# Altium schematic sheet TC-ADAPT.SchDoc
size A
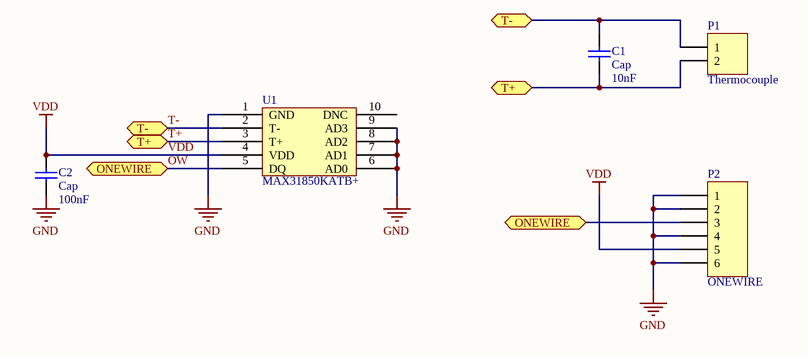
[diagram p0: TC-ADAPT.SchDoc]

## Parts
C1  Cap  value 10nF  [0603]
C2  Cap  value 100nF  [0603]
P1  Thermocouple  [PCC-SMP]
P2  ONEWIRE  [CONN MOD JACK R/A 6P6C]
U1  MAX31850KATB+  [TDFN-EP - MAX31850]

## Ports
ONEWIRE, T+, T-

## Nets
GND: C2.2 P2.1 P2.2 P2.4 P2.6 U1.1(GND) U1.6(AD0) U1.7(AD1) U1.8(AD2) U1.9(AD3)
VDD: C2.1 P2.5 U1.4(VDD)
OW: P2.3 U1.5(DQ) ; port ONEWIRE
T+: C1.2 P1.2 U1.3(T+) ; port T+
T-: C1.1 P1.1 U1.2(T-) ; port T-

Not connected (* = marked no-connect by the designer): U1 10(DNC)

## Library data of the parts
C1 C2 = Cap: Capacitor; Supplier 1: Digi-Key
  C1: Supplier Part Number 1: 1276-1009-1-ND
  C2: Supplier Part Number 1: 399-1095-1-ND
P1 = Header 2: Header, 2-Pin; LatestRevisionDate: 17-Jul-2002; LatestRevisionNote: Re-released for DXP Platform.; Publisher: Altium Limited
P2 = Header 6: Header, 6-Pin; Supplier Part Number 1: A105007CT-ND; Supplier 1: Digi-Key